# Altium schematic sheet dmpro16-pcb-v1-SystemClock.SchDoc
size A4; DocumentNumber: 16; SheetNumber: 16; SheetTotal: 17; SheetName: SystemClock
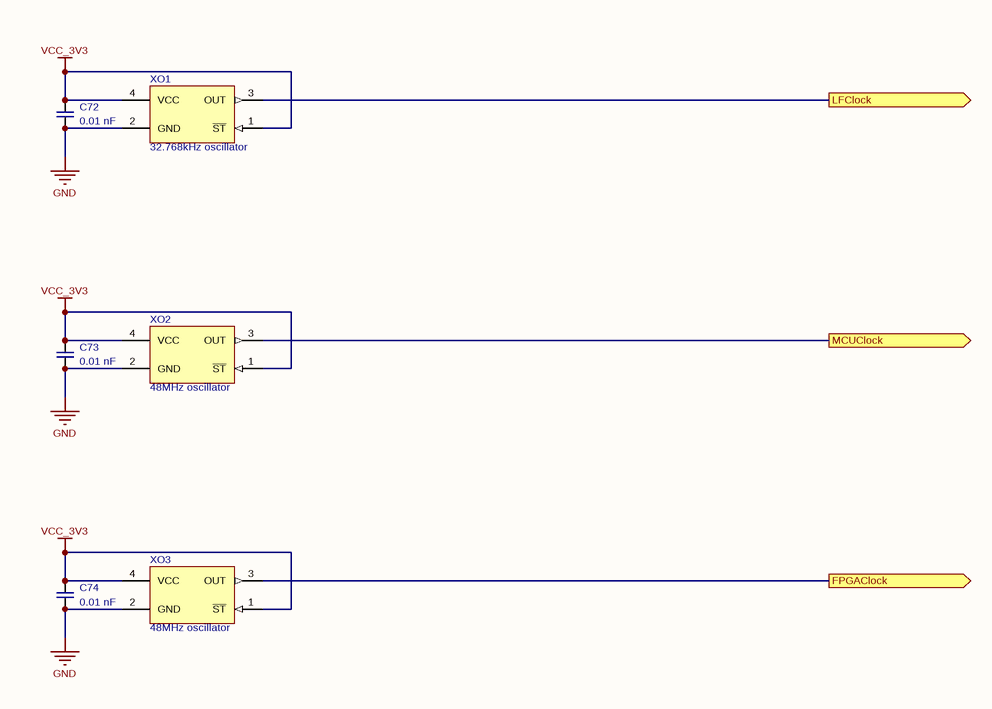
[diagram p0: dmpro16-pcb-v1-SystemClock.SchDoc]

## Parts
C72  0.01 nF  [CAPC2012_0h50]
C73  0.01 nF  [CAPC2012_0h50]
C74  0.01 nF  [CAPC2012_0h50]
XO1  32.768kHz oscillator  [FXO-HC73]
XO2  48MHz oscillator  [FXO-HC73]
XO3  48MHz oscillator  [FXO-HC73]

## Ports
FPGAClock (out), LFClock (out), MCUClock (out)

## Nets
GND: C72.1 C73.1 C74.1 XO1.2(GND) XO2.2(GND) XO3.2(GND)
VCC_3V3: C72.2 C73.2 C74.2 XO1.1(~{ST}) XO1.4(VCC) XO2.1(~{ST}) XO2.4(VCC) XO3.1(~{ST}) XO3.4(VCC)
FPGAClock: XO3.3(OUT) ; port FPGAClock
LFClock: XO1.3(OUT) ; port LFClock
MCUClock: XO2.3(OUT) ; port MCUClock

## Notes on the sheet
- Board:
- Version:
- Sheetname:
- Subject:
- Group:
- Sheet
- of
- Shematic file:

## Library data of the parts
C72-C74 = cap_unpol_1608_0.01uF: 0.01 uF unpolarized capacitor (1608 size); Voltage Rating: 6.3 V; Body Size (metric): 1608; Ideal Value: 0.01 nF
XO1 = osc_smd_standard_32.768kHz: Supply Voltage: 3.3 V; Frequency: 32.768 kHz
XO2 XO3 = osc_smd_standard_48MHz: Supply Voltage: 3.3 V; Frequency: 48 MHz